# Altium project QuadcopterDesign.PrjPcb (part 3 of 3)

## Sheet [4] Peripheral_Module.SchDoc
size A4; Organization: UNMEI ELECTRICAL; Address1: 16B/12 Nguyen Du Street; Address2: Da Lat City, LD Province; SheetNumber: 4; SheetTotal: 6
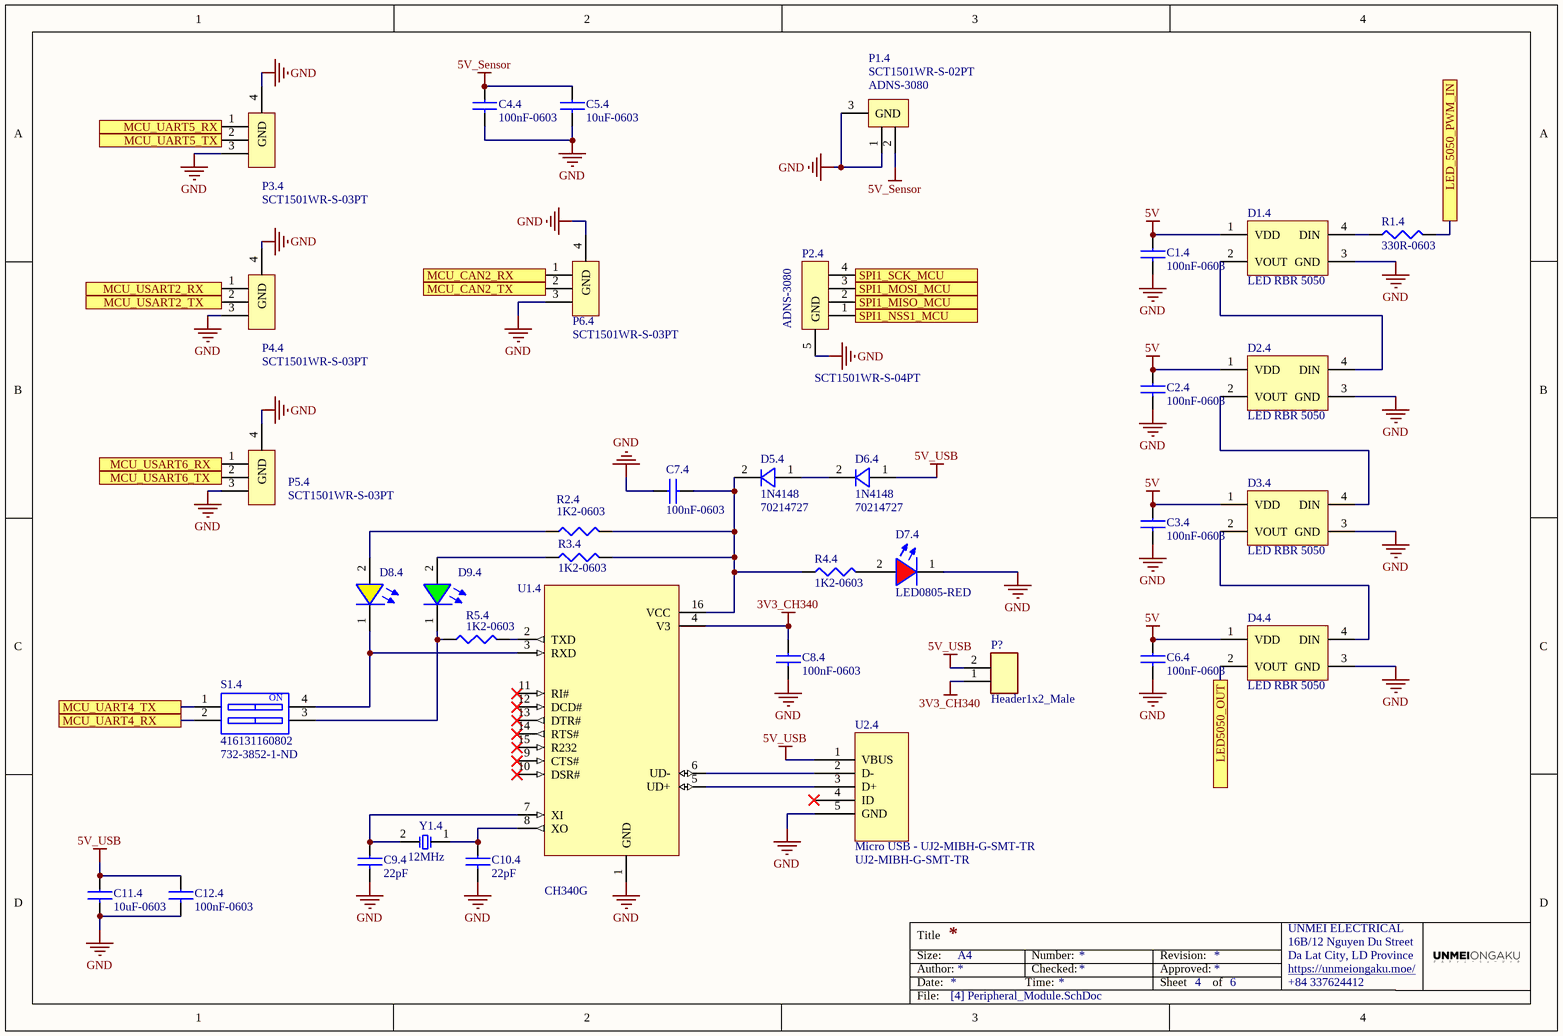
[diagram p3: [4] Peripheral_Module.SchDoc]

### Parts
C1.4  100nF-0603  [CAP0603]
C2.4  100nF-0603  [CAP0603]
C3.4  100nF-0603  [CAP0603]
C4.4  100nF-0603  [CAP0603]
C5.4  10uF-0603  [CAP0603]
C6.4  100nF-0603  [CAP0603]
C7.4  100nF-0603  [CAP0603]
C8.4  100nF-0603  [CAP0603]
C9.4  22pF  [CAP0603]
C10.4  22pF  [CAP0603]
C11.4  10uF-0603  [CAP0603]
C12.4  100nF-0603  [CAP0603]
D1.4  LED RBR 5050  [LED RGB  5050]
D2.4  LED RBR 5050  [LED RGB  5050]
D3.4  LED RBR 5050  [LED RGB  5050]
D4.4  LED RBR 5050  [LED RGB  5050]
D5.4  1N4148  Supplier Part Number 1: 70214727  [SOD-80]
D6.4  1N4148  Supplier Part Number 1: 70214727  [SOD-80]
D7.4  LED0805-RED  [LED0805-RED]
D8.4  YELLOW  [LED0805-YELLOW]  (value not drawn)
D9.4  GREEN  [LED0805-GREEN]  (value not drawn)
P1.4  SCT1501WR-S-02PT  [Connector ZH1.5 2P SMD]
P2.4  SCT1501WR-S-04PT  [Connector ZH1.5 4P SMD]
P3.4  SCT1501WR-S-03PT  [Connector ZH1.5 3P SMD]
P4.4  SCT1501WR-S-03PT  [Connector ZH1.5 3P SMD]
P5.4  SCT1501WR-S-03PT  [Connector ZH1.5 3P SMD]
P6.4  SCT1501WR-S-03PT  [Connector ZH1.5 3P SMD]
P?  Header1x2_Male  [HDR1x2_2.54_MALE]
R1.4  330R-0603  [RES0603 - 3D]
R2.4  1K2-0603  [RES0603 - 3D]
R3.4  1K2-0603  [RES0603 - 3D]
R4.4  1K2-0603  [RES0603 - 3D]
R5.4  1K2-0603  [RES0603 - 3D]
S1.4  416131160802  Supplier Part Number 1: 732-3852-1-ND  [DIP Switches SMD 1.27mm 2P]
U1.4  CH340G  [SOP16]
U2.4  Micro USB - UJ2-MIBH-G-SMT-TR  Supplier Part Number 1: UJ2-MIBH-G-SMT-TR  [Micro USB V2 SMD]
Y1.4  12MHz  [HC49-S]

### Ports
LED5050_OUT, LED_5050_PWM_IN, MCU_CAN2_RX, MCU_CAN2_TX, MCU_UART4_RX, MCU_UART4_TX, MCU_UART5_RX, MCU_UART5_TX, MCU_USART2_RX, MCU_USART2_TX, MCU_USART6_RX, MCU_USART6_TX, SPI1_MISO_MCU, SPI1_MOSI_MCU, SPI1_NSS1_MCU, SPI1_SCK_MCU

### Nets
3V3_CH340: C8.4.1 P?.1 U1.4.4(V3)
5V: C1.4.1 C2.4.1 C3.4.1 C4.4.1 C5.4.1 C6.4.1 D1.4.1(VDD) D2.4.1(VDD) D3.4.1(VDD) D4.4.1(VDD) P1.4.2  [also labelled 5V_Sensor]
5V_USB: C11.4.1 C12.4.1 D6.4.1(Anode) P?.2 U2.4.1(VBUS)
GND: C1.4.2 C2.4.2 C3.4.2 C4.4.2 C5.4.2 C6.4.2 C7.4.1 C8.4.2 C9.4.2 C10.4.2 C11.4.2 C12.4.2 D1.4.3(GND) D2.4.3(GND) D3.4.3(GND) D4.4.3(GND) D7.4.1(+) P1.4.1 P1.4.3(GND) P2.4.5(GND) P3.4.3 P3.4.4(GND) P4.4.3 P4.4.4(GND) P5.4.3 P5.4.4(GND) P6.4.3 P6.4.4(GND) U1.4.1(GND) U2.4.5(GND)
MCU_UART4_RX: S1.4.2 ; port MCU_UART4_RX
MCU_UART4_TX: S1.4.1 ; port MCU_UART4_TX
NetC7.4_2: C7.4.2 D5.4.2(Cathode) R2.4.2 R3.4.2 R4.4.1 U1.4.16(VCC)
NetC9.4_1: C9.4.1 U1.4.7(XI) Y1.4.2
NetC10.4_1: C10.4.1 U1.4.8(XO) Y1.4.1
NetD1.4_2: D1.4.2(VOUT) D2.4.4(DIN)
NetD1.4_4: D1.4.4(DIN) R1.4.1
NetD2.4_2: D2.4.2(VOUT) D3.4.4(DIN)
NetD3.4_2: D3.4.2(VOUT) D4.4.4(DIN)
NetD4.4_2: D4.4.2(VOUT) ; port LED5050_OUT
NetD5.4_1: D5.4.1(Anode) D6.4.2(Cathode)
NetD7.4_2: D7.4.2(+) R4.4.2
NetD8.4_1: D8.4.1(+) S1.4.4 U1.4.3(RXD)
NetD8.4_2: D8.4.2(+) R2.4.1
NetD9.4_1: D9.4.1(+) R5.4.1 S1.4.3
NetD9.4_2: D9.4.2(+) R3.4.1
NetP1.5_1: P2.4.4 ; port SPI1_SCK_MCU
NetP1.5_2: P2.4.3 ; port SPI1_MOSI_MCU
NetP1.5_3: P2.4.2 ; port SPI1_MISO_MCU
NetP2.4_1: P2.4.1 ; port SPI1_NSS1_MCU
NetP3.4_1: P3.4.1 ; port MCU_UART5_RX
NetP3.4_2: P3.4.2 ; port MCU_UART5_TX
NetP4.4_1: P4.4.1 ; port MCU_USART2_RX
NetP4.4_2: P4.4.2 ; port MCU_USART2_TX
NetP5.4_1: P5.4.1 ; port MCU_USART6_RX
NetP5.4_2: P5.4.2 ; port MCU_USART6_TX
NetP6.4_1: P6.4.1 ; port MCU_CAN2_RX
NetP6.4_2: P6.4.2 ; port MCU_CAN2_TX
NetR1.4_2: R1.4.2 ; port LED_5050_PWM_IN
NetR5.4_2: R5.4.2 U1.4.2(TXD)
NetU1.4_5: U1.4.5(UD+) U2.4.3(D+)
NetU1.4_6: U1.4.6(UD-) U2.4.2(D-)

Not connected (* = marked no-connect by the designer): U1.4 9(CTS#)* 10(DSR#)* 11(RI#)* 12(DCD#)* 13(DTR#)* 14(RTS#)* 15(R232)*; U2.4 4(ID)*

### Notes on the sheet
- (near P1.4) ADNS-3080
- (near P2.4) ADNS-3080
- Title
- Size:
- Date:
- Author:
- A4
- Time:
- Number:
- Checked:
- Revision:
- Sheet
- Approved:
- of
- https://unmeiongaku.moe/
- +84 337624412
- File:
- (in symbol 416131160802) ON

### Library data of the parts
C1.4 C2.4 C3.4 C6.4 = CC0603KRX7R0BB104: CAP CER 0.1UF 100V X7R 0603; Manufacturer: Yageo; Tolerance: ±10%; Value: 100nF; Supplier 1: Digi-Key; Manufacturer Part Number: CC0603KRX7R0BB104; RoHS: RoHS Compliant; Category: Capacitors; Stock 1: 784508; Pricing 1: 1=0.23, 10=0.156, 100=0.0791, 500=0.05414, 1000=0.0479 (USD); Packaging: Cut Tape (CT); Part Status: Active; Temperature Coefficient: X7R; Operating Temperature: -55°C ~ 125°C; Features: -; Ratings: -; Applications: General Purpose; Failure Rate: -; Mounting Type: Surface Mount, MLCC; Package / Case: 0603 (1608 Metric); Size / Dimension: 0.063" L x 0.032" W (1.60mm x 0.80mm); Height - Seated (Max): -; Thickness (Max): 0.035" (0.90mm); Lead Spacing: -; Lead Style: -; ComponentLink1URL: http://media.digikey.com/pdf/Data%20Sheets/Yageo%20PDFs/NPO,%20X7R%20Mid-voltage.pdf; ComponentLink1Description: http://media.digikey.com/pdf/Data%20Sheets/Yageo%20PDFs/NPO,%20X7R%20Mid-voltage.pdf; Supplier Part Number 1: 311-1523-1-ND; Voltage - Rated: 100V
C4.4 C7.4 C8.4 C12.4 = CC0603KRX7R9BB104: CAP CER 0.1UF 50V X7R 0603; Manufacturer 1: Yageo; Category 1: Capacitors; Capacitance: 0.1µF; Tolerance: ±10%; Value: 100nF; Supplier 1: Digi-Key; Supplier Part Number 1: 311-1344-1-ND; Manufacturer Part Number 1: CC0603KRX7R9BB104; RoHS 1: RoHS Compliant; Description 1: CAP CER 0.1UF 50V X7R 0603; Stock 1: 4411645; Pricing 1: 1=0.1, 10=0.031, 100=0.014, 500=0.00998, 1000=0.00783 (USD); Packaging: Cut Tape (CT); Part Status: Active; Voltage - Rated: 50V; Temperature Coefficient: X7R; Operating Temperature: -55°C ~ 125°C; Features: -; Ratings: -; Applications: General Purpose; Failure Rate: -; Mounting Type: Surface Mount, MLCC; Package / Case: 0603 (1608 Metric); Size / Dimension: 0.063" L x 0.031" W (1.60mm x 0.80mm); Height - Seated (Max): -; Thickness (Max): 0.035" (0.90mm); Lead Spacing: -; Lead Style: -; ComponentLink1URL: http://www.yageo.com/documents/recent/UPY-GPHC_X7R_6.3V-to-50V_18.pdf; ComponentLink1Description: http://www.yageo.com/documents/recent/UPY-GPHC_X7R_6.3V-to-50V_18.pdf
C5.4 C11.4 = CC0603KRX5R6BB106: CAP CER 10UF 10V X5R 0603; Manufacturer 1: Yageo; Category 1: Capacitors; Capacitance: 10µF; Tolerance: ±10%; Supplier 1: Digi-Key; Supplier Part Number 1: 311-1782-1-ND; Manufacturer Part Number 1: CC0603KRX5R6BB106; RoHS 1: RoHS Compliant; Description 1: CAP CER 10UF 10V X5R 0603; Stock 1: 66566; Pricing 1: 1=0.33, 10=0.225, 100=0.1272, 500=0.08982, 1000=0.07858 (USD); Packaging: Cut Tape (CT); Part Status: Active; Voltage - Rated: 10V; Temperature Coefficient: X5R; Operating Temperature: -55°C ~ 85°C; Features: -; Ratings: -; Applications: General Purpose; Failure Rate: -; Mounting Type: Surface Mount, MLCC; Package / Case: 0603 (1608 Metric); Size / Dimension: 0.063" L x 0.031" W (1.60mm x 0.80mm); Height - Seated (Max): -; Thickness (Max): 0.035" (0.90mm); Lead Spacing: -; Lead Style: -; ComponentLink1URL: http://www.yageo.com/documents/recent/UPY-GPHC_X5R_4V-to-50V_24.pdf; ComponentLink1Description: http://www.yageo.com/documents/recent/UPY-GPHC_X5R_4V-to-50V_24.pdf; Value: 10uF
C9.4 C10.4 = CC0603JRNPO9BN220: Surface Mount Ceramic Multilayer Capacitor 22pF 5% C0G 50V 0603 Paper T/R; Manufacturer: Yageo; Insulation Resistance: 10GR; Temperature Coefficient: 30ppm/°C; Supplier 1: Newark; Manufacturer Part Number: CC0603JRNPO9BN220; RoHS: Yes; Category: Ceramic Capacitors; Stock 1: 70605; Pricing 1: 1=0.10000, 10=0.02100, 25=0.02000, 50=0.01900, 100=0.01800 (USD); Mount: Surface Mount; Case/Package: 0603; Number of Pins: 2; Case Code (Imperial): 0603; Case Code (Metric): 1608; Min Operating Temperature: -55°C; Max Operating Temperature: 125°C; Capacitance: 22pF; Tolerance: 5%; Voltage Rating: 50V; Packaging: Tape and Reel; Dielectric: C0G; Termination: SMD/SMT; Series: CC; Voltage Rating (DC): 50V; Package Quantity: 1; Voltage: 50V; Length: 1.6mm; Width: 0.031inch; Height: 0.8mm; Thickness: 0.035inch; Depth: 0.8mm; Radiation Hardening: No; Lead Free: Lead Free; RoHS Compliant: Yes; Reach SVHC Compliant: Yes; Supplier Part Number 1: 46WX087
D1.4 D2.4 D3.4 D4.4 = LED RBR 5050 - IN-PI55QATPRPGPBPW-60: Address Led Discrete Serial Rgbw; Manufacturer: Inolux; Color: White,Blue,Green,Red; Lens Style: Round,Flat; Luminous Intensity: 1850mcd; Forward Voltage: 5.2V; Test Current: 12mA; Dominant Wavelength: 465nm; Supplier 1: Arrow Electronics; Manufacturer Part Number: IN-PI55QATPRPGPBPW-60; RoHS: No; Category: LEDs; Stock 1: 964; Pricing 1: 1=0.71450, 10=0.46990, 25=0.46520, 100=0.30470, 250=0.30220, 500=0.29430 (USD); Mount: Surface Mount; Case/Package: SMD/SMT; Packaging: Tape and Reel; Length: 5mm; Width: 5mm; Height: 1.7mm; ComponentLink1URL: http://www.inolux-corp.com/datasheet/SMDLED/Addressable%20LED/IN-PI55QATPRPGPBPW-XX_v1.2.pdf?src-supplier=Digi-Key; ComponentLink1Description: http://www.inolux-corp.com/datasheet/SMDLED/Addressable%20LED/IN-PI55QATPRPGPBPW-XX_v1.2.pdf?src-supplier=Digi-Key; Supplier Part Number 1: IN-PI55QATPRPGPBPW-60
D5.4 D6.4 = 1N4148: Rectifier Diode Small Signal Switching 100V 0.2A 4ns Automotive 2-Pin DO-35 Ammo; Manufacturer: NTE Electronics; Forward Voltage: 1V; Element Configuration: Single; Max Repetitive Reverse Voltage (Vrrm): 75V; Forward Current: 300mA; Current Rating: 200mA; Polarity: Standard; Capacitance: 4pF; Max Forward Surge Current (Ifsm): 1A; Power Dissipation: 500mW; Supplier 1: Allied Electronics; Manufacturer Part Number: 1N4148; RoHS: Yes; Category: Rectifier Diodes; Stock 1: 5690; Pricing 1: 1=0.08800 (USD); Mount: Through Hole; Case/Package: DO-35; Number of Pins: 2; Min Operating Temperature: -65°C; Max Operating Temperature: 175°C; Packaging: Tape and Reel; Reverse Recovery Time: 4ns; Voltage Rating (DC): 100V; Output Current: 200mA; Diameter: 2mm; Length: 4mm; RoHS Compliant: Yes; Lead Free: Lead Free; ComponentLink1URL: https://datasheet.ciiva.com/7624/1n4148-4448-7624426.pdf?src-supplier=Element14; ComponentLink1Description: https://datasheet.ciiva.com/7624/1n4148-4448-7624426.pdf?src-supplier=Element14
D8.4 = LED0805-YELLOW
D9.4 = LED0805-GREEN
P? = HDR1x2_2.54_MALE: Header1x2_2.54_MALE
R1.4 = RC0603JR-07330RL: RES SMD 330 OHM 5% 1/10W 0603; Manufacturer 1: Yageo; Category 1: Resistors; Resistance (Ohms): 330; Power (Watts): 0.1W, 1/10W; Temperature Coefficient: ±100ppm/°C; Value: 330R; Supplier 1: Digi-Key; Supplier Part Number 1: 311-330GRCT-ND; Manufacturer Part Number 1: RC0603JR-07330RL; RoHS 1: RoHS Compliant; Description 1: RES SMD 330 OHM 5% 1/10W 0603; Stock 1: 1463213; Pricing 1: 1=0.1, 10=0.011, 100=0.0046, 1000=0.00207, 2500=0.0018 (USD); Packaging: Cut Tape (CT); Part Status: Active; Tolerance: ±5%; Composition: Thick Film; Features: Moisture Resistant; Operating Temperature: -55°C ~ 155°C; Package / Case: 0603 (1608 Metric); Supplier Device Package: 0603; Size / Dimension: 0.063" L x 0.031" W (1.60mm x 0.80mm); Height - Seated (Max): 0.022" (0.55mm); Failure Rate: -; ComponentLink1URL: http://www.yageo.com/documents/recent/PYu-RC_Group_51_RoHS_L_7.pdf; ComponentLink1Description: http://www.yageo.com/documents/recent/PYu-RC_Group_51_RoHS_L_7.pdf
R2.4 R3.4 R4.4 R5.4 = RC0603JR-071K2L: RES SMD 1.2K OHM 5% 1/10W 0603; Manufacturer 1: Yageo; Category 1: Resistors; Power (Watts): 0.1W, 1/10W; Temperature Coefficient: ±100ppm/°C; Value: 1K2; Supplier 1: Digi-Key; Supplier Part Number 1: 311-1.2KGRCT-ND; Manufacturer Part Number 1: RC0603JR-071K2L; RoHS 1: RoHS Compliant; Description 1: RES SMD 1.2K OHM 5% 1/10W 0603; Stock 1: 286942; Pricing 1: 1=0.1, 10=0.011, 100=0.0046, 1000=0.00207, 2500=0.0018 (USD); Packaging: Cut Tape (CT); Part Status: Active; Resistance (Ohms): 1.2k; Tolerance: ±5%; Composition: Thick Film; Features: Moisture Resistant; Operating Temperature: -55°C ~ 155°C; Package / Case: 0603 (1608 Metric); Supplier Device Package: 0603; Size / Dimension: 0.063" L x 0.031" W (1.60mm x 0.80mm); Height - Seated (Max): 0.022" (0.55mm); Failure Rate: -; ComponentLink1URL: http://www.yageo.com/documents/recent/PYu-RC_Group_51_RoHS_L_7.pdf; ComponentLink1Description: http://www.yageo.com/documents/recent/PYu-RC_Group_51_RoHS_L_7.pdf
S1.4 = 416131160802: DIP Switch Dimensions L x W x H: 5.6 x 2 mm Series: WS-DISV L: 3.58 mm Poles: 2; Manufacturer: Wurth Electronics; Body Material: Polyphenylene,Polyphthalamide; Mechanical Life: 2000Cycles; Contact Current Rating: 25mA; Contact Resistance: 50mR; Number of Positions: 2; Voltage Rating (DC): 24V; Electrical Life: 1000Cycles; Throw Configuration: SPST; Insulation Resistance: 100MR; Actuator Type: Slide (Standard); Pitch: 0.05inch; Washable: Yes; Supplier 1: Digi-Key; Manufacturer Part Number: 416131160802; RoHS: Yes; Category: DIP Switches; Stock 1: 2793; Pricing 1: 1=5.06000, 10=4.81100, 50=4.55800, 100=4.05100, 500=3.79800 (USD); Mount: Surface Mount; Contact Material: Copper Alloy,Gold; Contact Plating: Gold; Min Operating Temperature: -40°C; Max Operating Temperature: 85°C; Package Quantity: 1; Packaging: Cut Tape; Current Rating: 25mA; Termination: Gull Wing; Number of Circuits: 2; Max Voltage Rating (DC): 24V; Series: WS-DISV; Length: 0.141inch; Width: 5.6mm; Height: 2mm; Lead Free: Lead Free; RoHS Compliant: Yes; ComponentLink1URL: https://datasheet.ciiva.com/30467/0900766b812902d9-30467106.pdf?src-supplier=RSComponents; ComponentLink1Description: https://datasheet.ciiva.com/30467/0900766b812902d9-30467106.pdf?src-supplier=RSComponents; ComponentLink2URL: https://datasheet.ciiva.com/2863/4161311608xx-2863669.pdf?src-supplier=Digi-Key; ComponentLink2Description: https://datasheet.ciiva.com/2863/4161311608xx-2863669.pdf?src-supplier=Digi-Key; ComponentLink3URL: https://datasheet.ciiva.com/2863/4161311608xx-2863670.pdf?src-supplier=Digi-Key; ComponentLink3Description: https://datasheet.ciiva.com/2863/4161311608xx-2863670.pdf?src-supplier=Digi-Key
U1.4 = CH340G: USB2UART
U2.4 = Micro USB - UJ2-MIBH-G-SMT-TR: Conn Micro USB 2.0 Type B RCP 5 POS 0.65mm Solder RA SMD 5 Terminal 1 Port T/R; Manufacturer: CUI Devices; Supplier 1: Arrow Electronics; Manufacturer Part Number: UJ2-MIBH-G-SMT-TR; RoHS: Yes; Category: USB Connectors; Stock 1: 6066; Pricing 1: 1=0.44640, 10=0.33470, 25=0.33130, 50=0.32680, 100=0.29350, 250=0.28070, 500=0.26500, 1000=0.21660, 2000=0.19850, 3000=0.19000, 5000=0.18820 (USD)
Y1.4 = Crystals - HC49SSDLF-8.00MHz: Crystals LO-PRO 8MHz; Manufacturer: Fox Electronics; Supplier 1: Mouser; Manufacturer Part Number: HC49SSDLF-8.00MHz; RoHS: Yes; Category: Uncategorized; Frequency: 8MHz; Packaging: Tape and Reel; Package Quantity: 1000; Termination: SMD/SMT; Length: 13.2mm; Width: 5mm; Height: 3.2mm; ComponentLink1URL: https://datasheet.ciiva.com/12388/hc49ssdlf-16337-12388064.pdf?src-supplier=Mouser; ComponentLink1Description: https://datasheet.ciiva.com/12388/hc49ssdlf-16337-12388064.pdf?src-supplier=Mouser; Supplier Part Number 1: 559-280LF-080

## Sheet [5] Radio Frequency.SchDoc
size A4; Organization: UNMEI ELECTRICAL; Address1: 16B/12 Nguyen Du Street; Address2: Da Lat City, LD Province; SheetNumber: 5; SheetTotal: 6
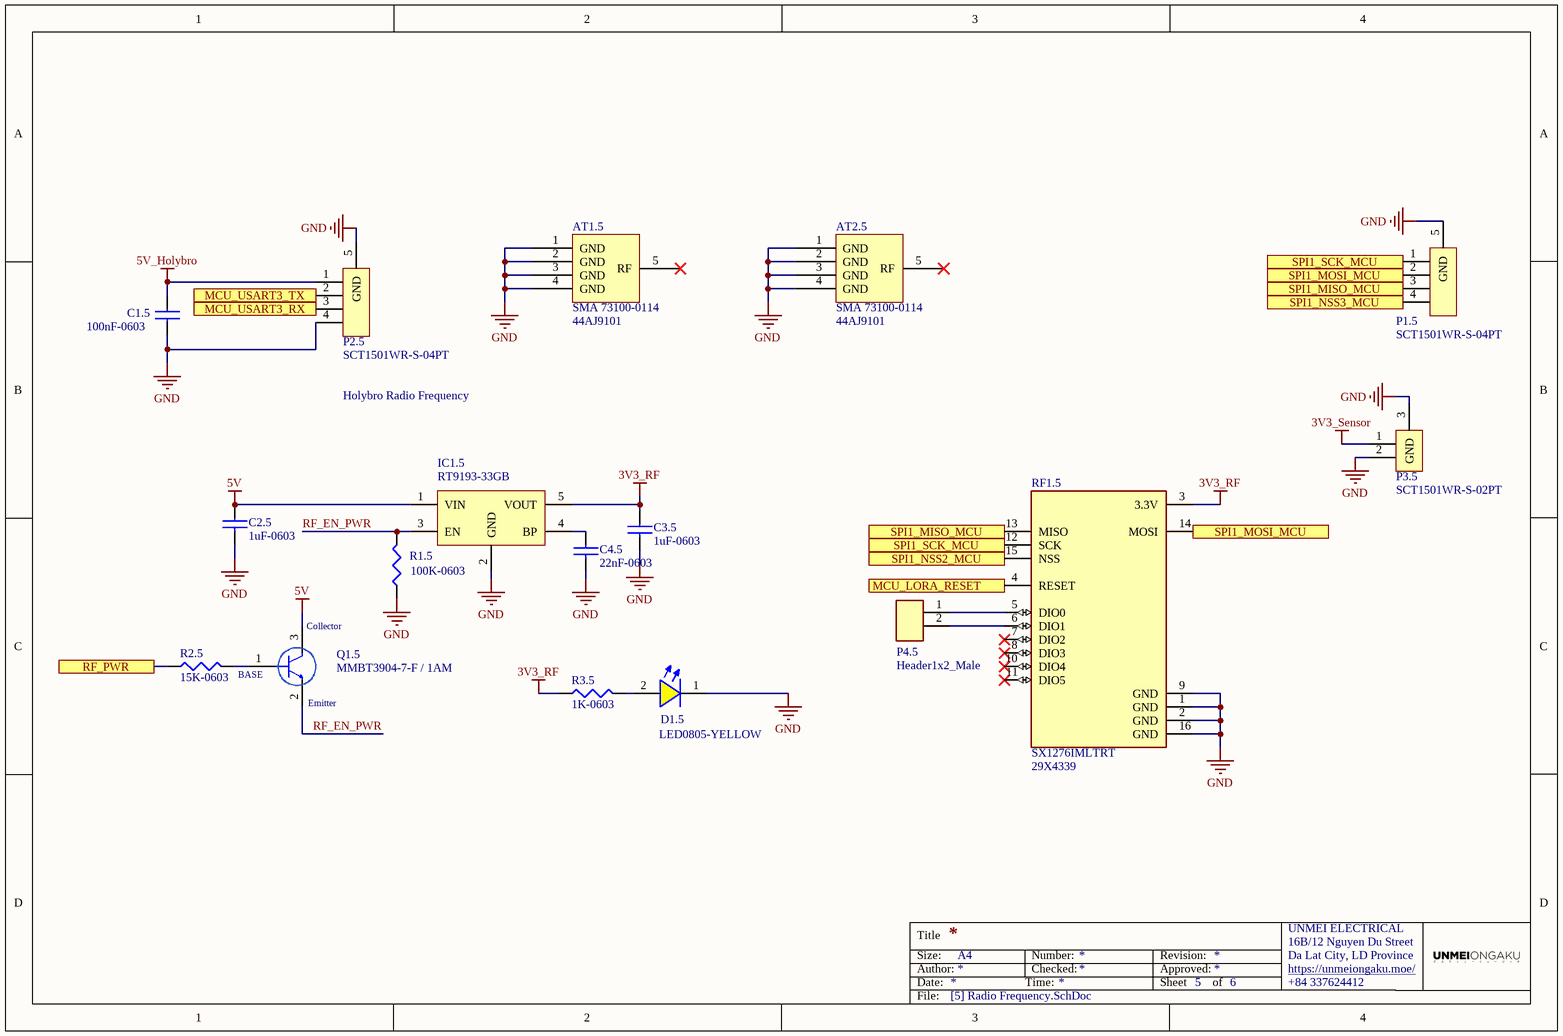
[diagram p4: [5] Radio Frequency.SchDoc]

### Parts
AT1.5  SMA 73100-0114  Supplier Part Number 1: 44AJ9101  [SMA Antenna Connection Jack]
AT2.5  SMA 73100-0114  Supplier Part Number 1: 44AJ9101  [SMA Antenna Connection Jack]
C1.5  100nF-0603  [CAP0603]
C2.5  1uF-0603  [CAP0603]
C3.5  1uF-0603  [CAP0603]
C4.5  22nF-0603  [CAP0603]
D1.5  LED0805-YELLOW  [LED0805-YELLOW]
IC1.5  RT9193-33GB  [SOT23-5]
P1.5  SCT1501WR-S-04PT  [Connector ZH1.5 4P SMD]
P2.5  SCT1501WR-S-04PT  [Connector ZH1.5 4P SMD]
P3.5  SCT1501WR-S-02PT  [Connector ZH1.5 2P SMD]
P4.5  Header1x2_Male  [HDR1x2_2.54_MALE]
Q1.5  MMBT3904-7-F / 1AM  [SOT23]
R1.5  100K-0603  [RES0603 - 3D]
R2.5  15K-0603  [RES0603 - 3D]
R3.5  1K-0603  [RES0603 - 3D]
RF1.5  SX1276IMLTRT  Supplier Part Number 1: 29X4339  [Lora SX1278 433MHz  / Ai-Thinker Ra-02]

### Ports
MCU_LORA_RESET, MCU_USART3_RX, MCU_USART3_TX, RF_PWR, SPI1_MISO_MCU, SPI1_MOSI_MCU, SPI1_NSS2_MCU, SPI1_NSS3_MCU, SPI1_SCK_MCU

### Nets
3V3_RF: C3.5.1 IC1.5.5(VOUT) R3.5.1 RF1.5.3(3.3V)
3V3_Sensor: P3.5.1
5V: C1.5.1 C2.5.1 IC1.5.1(VIN) P2.5.1 Q1.5.3  [also labelled 5V_Holybro]
GND: AT1.5.1(GND) AT1.5.2(GND) AT1.5.3(GND) AT1.5.4(GND) AT2.5.1(GND) AT2.5.2(GND) AT2.5.3(GND) AT2.5.4(GND) C1.5.2 C2.5.2 C3.5.2 C4.5.2 D1.5.1(+) IC1.5.2(GND) P1.5.5(GND) P2.5.4 P2.5.5(GND) P3.5.2 P3.5.3(GND) R1.5.1 RF1.5.1(GND) RF1.5.2(GND) RF1.5.9(GND) RF1.5.16(GND)
RF_EN_PWR: IC1.5.3(EN) Q1.5.2 R1.5.2
NetC4.5_1: C4.5.1 IC1.5.4(BP)
NetD1.5_2: D1.5.2(+) R3.5.2
NetP1.5_1: P1.5.1 RF1.5.12(SCK) ; port SPI1_SCK_MCU
NetP1.5_2: P1.5.2 RF1.5.14(MOSI) ; port SPI1_MOSI_MCU
NetP1.5_3: P1.5.3 RF1.5.13(MISO) ; port SPI1_MISO_MCU
NetP1.5_4: P1.5.4 ; port SPI1_NSS3_MCU
NetP2.5_2: P2.5.2 ; port MCU_USART3_TX
NetP2.5_3: P2.5.3 ; port MCU_USART3_RX
NetP4.5_1: P4.5.1 RF1.5.5(DIO0)
NetP4.5_2: P4.5.2 RF1.5.6(DIO1)
NetQ1.5_1: Q1.5.1 R2.5.2
NetR2.5_1: R2.5.1 ; port RF_PWR
NetRF1.5_4: RF1.5.4(RESET) ; port MCU_LORA_RESET
NetRF1.5_15: RF1.5.15(NSS) ; port SPI1_NSS2_MCU

Not connected (* = marked no-connect by the designer): AT1.5 5(RF)*; AT2.5 5(RF)*; RF1.5 7(DIO2)* 8(DIO3)* 10(DIO4)* 11(DIO5)*

### Notes on the sheet
- Holybro Radio Frequency
- Title
- Size:
- Date:
- Author:
- A4
- Time:
- Number:
- Checked:
- Revision:
- Sheet
- Approved:
- of
- https://unmeiongaku.moe/
- +84 337624412
- File:
- (in symbol MMBT3904-7-F / 1AM) Collector; BASE; Emitter

### Library data of the parts
AT1.5 AT2.5 = SMA 73100-0114: RF SMA Connector, 1 Contact(s), Female, Board Mount, Solder Terminal, Locking, Receptacle; Manufacturer: Molex; Body Material: Brass; Body Plating: Gold; Dielectric Material: PTFE; Polarity: Normal; Connector Type: PCB,SMA,Coaxial; Impedance: 50R; Frequency: 12Hz; Operating Frequency: 0 to 12Hz; Max Frequency: 18GHz; Voltage Rating: 500V; Supplier 1: Newark; Manufacturer Part Number: 73100-0114; RoHS: Yes; Category: RF / Coaxial Connectors; Stock 1: 2371; Pricing 1: 1=8.21000, 5=7.67000, 10=7.13000, 25=6.72000, 50=6.30000, 100=5.89000 (USD); Mount: Through Hole; Case/Package: SMA; Contact Plating: Gold; Contact Material: Copper; Insulation Material: Teflon; Housing Color: Gold; Plating: Gold; Center Contact Plating: Gold; Min Operating Temperature: -65°C; Max Operating Temperature: 165°C; Package Quantity: 1760; Packaging: Tray; Series: 73100; Termination: Solder; Orientation: Right Angle; Gender: Female; Fastening Type: Threaded; Length: 14.8mm; Radiation Hardening: No; RoHS Compliant: Yes
C1.5 = CC0603KRX7R9BB104: as C4.4 on sheet [4] Peripheral_Module; Supplier 1: Digi-Key; Supplier Part Number 1: 311-1344-1-ND; Manufacturer Part Number 1: CC0603KRX7R9BB104; RoHS 1: RoHS Compliant; Description 1: CAP CER 0.1UF 50V X7R 0603; Stock 1: 4411645; Pricing 1: 1=0.1, 10=0.031, 100=0.014, 500=0.00998, 1000=0.00783 (USD); Packaging: Cut Tape (CT); Part Status: Active; Voltage - Rated: 50V; Temperature Coefficient: X7R; Operating Temperature: -55°C ~ 125°C; Features: -; Ratings: -; Applications: General Purpose; Failure Rate: -; Mounting Type: Surface Mount, MLCC; Package / Case: 0603 (1608 Metric); Size / Dimension: 0.063" L x 0.031" W (1.60mm x 0.80mm); Height - Seated (Max): -; Thickness (Max): 0.035" (0.90mm); Lead Spacing: -; Lead Style: -; ComponentLink1URL: http://www.yageo.com/documents/recent/UPY-GPHC_X7R_6.3V-to-50V_18.pdf; ComponentLink1Description: http://www.yageo.com/documents/recent/UPY-GPHC_X7R_6.3V-to-50V_18.pdf
C2.5 C3.5 = CC0603KRX7R7BB105: CAP CER 1UF 16V X7R 0603; Manufacturer 1: Yageo; Category 1: Capacitors; Capacitance: 1µF; Tolerance: ±10%; Supplier 1: Digi-Key; Supplier Part Number 1: 311-1446-1-ND; Manufacturer Part Number 1: CC0603KRX7R7BB105; RoHS 1: RoHS Compliant; Description 1: CAP CER 1UF 16V X7R 0603; Stock 1: 274580; Pricing 1: 1=0.1, 10=0.051, 100=0.0227, 500=0.0162, 1000=0.01274 (USD); Packaging: Cut Tape (CT); Part Status: Active; Voltage - Rated: 16V; Temperature Coefficient: X7R; Operating Temperature: -55°C ~ 125°C; Features: -; Ratings: -; Applications: General Purpose; Failure Rate: -; Mounting Type: Surface Mount, MLCC; Package / Case: 0603 (1608 Metric); Size / Dimension: 0.063" L x 0.031" W (1.60mm x 0.80mm); Height - Seated (Max): -; Thickness (Max): 0.035" (0.90mm); Lead Spacing: -; Lead Style: -; ComponentLink1URL: http://www.yageo.com/documents/recent/UPY-GPHC_X7R_6.3V-to-50V_18.pdf; ComponentLink1Description: http://www.yageo.com/documents/recent/UPY-GPHC_X7R_6.3V-to-50V_18.pdf; Value: 1uF
C4.5 = CC0603KRX7R9BB223: Multilayer Ceramic Capacitors MLCC - SMD/SMT 22nF 50V X7R 10%; Manufacturer: Yageo; Capacitance: 0.022 uF; Type: General Purpose and High Capacitance Surface Mount Ceramic Multilayer Capacitor; Voltage Rating DC: 50 VDC; Capacitance - pF: 22000 pF; Class: Class 2; Supplier 1: Mouser; Manufacturer Part Number: CC0603KRX7R9BB223; RoHS: RoHS Compliant; Category: Multilayer Ceramic Capacitors MLCC - SMD/SMT; Stock 1: 23033; Pricing 1: 1=0.100, 10=0.064, 100=0.020, 1000=0.015, 4000=0.011, 8000=0.010, 24000=0.009 (USD); Height: 0.8 mm; Length: 1.6 mm; Package / Case: 0603 (1608 metric); Packaging: Cut Tape; Product: General Type MLCCs; Series: CC; Termination Style: SMD/SMT; Tolerance: 10 %; Width: 0.8 mm; Brand: Yageo; Capacitance - nF: 22 nF; Case Code - in: 0603; Case Code - mm: 1608; Dielectric: X7R; Maximum Operating Temperature: + 125 C; Minimum Operating Temperature: - 55 C; Product Type: Ceramic Capacitors; Standard Pack Qty: 4000; Subcategory: Capacitors; Termination: Standard; RoHS - Mouser: Y; Minimum Order Quantity: 1; Reeling: True; ComponentLink1URL: https://www.mouser.com/datasheet/2/447/UPY-GPHC_X7R_6.3V-to-50V_18-1154002.pdf; ComponentLink1Description: https://www.mouser.com/datasheet/2/447/UPY-GPHC_X7R_6.3V-to-50V_18-1154002.pdf; Supplier Part Number 1: 603-CC603KRX7R9BB223; Value: 22nF
IC1.5 = RT9193-33GB: IC REG LDO 3.3V 0.3A SOT23-5
P4.5 = HDR1x2_2.54_MALE: Header1x2_2.54_MALE
Q1.5 = MMBT3904-7-F / 1AM: Transistor General Purpose BJT NPN 40 Volt 0.2A Automotive 3-Pin SOT-23; Manufacturer: Diodes Zetex; Collector Emitter Breakdown Voltage: 40V; Max Power Dissipation: 300mW; Max Collector Current: 200mA; Transition Frequency: 300MHz; Collector Base Voltage (VCBO): 60V; Emitter Base Voltage (VEBO): 6V; Collector Emitter Saturation Voltage: 300mV; Element Configuration: Single; hFE Min: 100; Power Dissipation: 350mW; Number of Elements: 1; Supplier 1: Digi-Key; Manufacturer Part Number: MMBT3904-7-F; RoHS: Yes; Category: BJTs; Stock 1: 468030; Pricing 1: 3000=0.02271, 6000=0.02048, 15000=0.01781, 30000=0.01603, 75000=0.01425 (USD); Mount: Surface Mount; Case/Package: SOT-23; Number of Pins: 3; Contact Plating: Tin,Matte; Weight: 0.000282oz; Min Operating Temperature: -55°C; Max Operating Temperature: 150°C; Packaging: Tape and Reel; Polarity: NPN; Package Quantity: 3000; Collector Emitter Voltage (VCEO): 40V; Gain Bandwidth Product: 300MHz; Frequency: 300MHz; Max Breakdown Voltage: 40V; Series: -; Collector-emitter Voltage-Max: 300mV; Voltage Rating (DC): 40V; Max Frequency: 300MHz; Continuous Collector Current: 200mA; Length: 3.05mm; Width: 1.4mm; Height: 1mm; Radiation Hardening: No; RoHS Compliant: Yes; Lead Free: Lead Free; REACH SVHC: No SVHC; ComponentLink1URL: https://datasheet.ciiva.com/11201/ds30036-11201778.pdf?src-supplier=Avnet; ComponentLink1Description: https://datasheet.ciiva.com/11201/ds30036-11201778.pdf?src-supplier=Avnet; ComponentLink2URL: https://datasheet.ciiva.com/15138/getdatasheetpartid-53265-15138780.pdf?src-supplier=Verical; ComponentLink2Description: https://datasheet.ciiva.com/15138/getdatasheetpartid-53265-15138780.pdf?src-supplier=Verical; ComponentLink3URL: https://datasheet.ciiva.com/22711/1915516-22711750.pdf?src-supplier=Element14; ComponentLink3Description: https://datasheet.ciiva.com/22711/1915516-22711750.pdf?src-supplier=Element14; ComponentLink4URL: https://datasheet.ciiva.com/11198/ds30036-11198999.pdf?src-supplier=Avnet; ComponentLink4Description: https://datasheet.ciiva.com/11198/ds30036-11198999.pdf?src-supplier=Avnet; ComponentLink5URL: https://datasheet.ciiva.com/6361/ds30036-6361256.pdf?src-supplier=Digi-Key; ComponentLink5Description: https://datasheet.ciiva.com/6361/ds30036-6361256.pdf?src-supplier=Digi-Key; ComponentLink6URL: https://datasheet.ciiva.com/6361/ds30036-6361254.pdf?src-supplier=Digi-Key; ComponentLink6Description: https://datasheet.ciiva.com/6361/ds30036-6361254.pdf?src-supplier=Digi-Key; Supplier Part Number 1: MMBT3904-FDITR-ND
R1.5 = RC0603JR-07100KL: RES SMD 100K OHM 5% 1/10W 0603; Manufacturer 1: Yageo; Category 1: Resistors; Power (Watts): 0.1W, 1/10W; Temperature Coefficient: ±100ppm/°C; Supplier 1: Digi-Key; Supplier Part Number 1: 311-100KGRCT-ND; Manufacturer Part Number 1: RC0603JR-07100KL; RoHS 1: RoHS Compliant; Description 1: RES SMD 100K OHM 5% 1/10W 0603; Stock 1: 3591837; Pricing 1: 1=0.1, 10=0.011, 100=0.0044, 1000=0.00198, 2500=0.00172 (USD); Packaging: Cut Tape (CT); Part Status: Active; Resistance (Ohms): 100k; Tolerance: ±5%; Composition: Thick Film; Features: Moisture Resistant; Operating Temperature: -55°C ~ 155°C; Package / Case: 0603 (1608 Metric); Supplier Device Package: 0603; Size / Dimension: 0.063" L x 0.031" W (1.60mm x 0.80mm); Height - Seated (Max): 0.022" (0.55mm); Failure Rate: -; ComponentLink1URL: http://www.yageo.com/documents/recent/PYu-RC_Group_51_RoHS_L_7.pdf; ComponentLink1Description: http://www.yageo.com/documents/recent/PYu-RC_Group_51_RoHS_L_7.pdf; Value: 100K
R2.5 = RC0603JR-0715KL: Thick Film Resistors - SMD 15K OHM 5%; Manufacturer: Yageo; Power Rating: 100 mW, 200 mW; Resistance: 15 kOhms; Temperature Coefficient: 100 PPM / C; Voltage Rating: 75 V; Supplier 1: Mouser; Manufacturer Part Number: RC0603JR-0715KL; RoHS: RoHS Compliant; Category: Thick Film Resistors - SMD; Stock 1: 39889; Pricing 1: 1=0.100, 10=0.015, 100=0.005, 1000=0.004, 5000=0.004 (USD); Application: High Reliability; Features: -; Height: 0.45 mm; Length: 1.6 mm; Package / Case: 0603 (1608 metric); Packaging: Cut Tape; Product: Thick Film Resistors SMD; Series: RC; Technology: Thick Film; Termination Style: SMD/SMT; Tolerance: 5 %; Type: General Purpose; Width: 0.8 mm; Brand: Yageo; Mounting Style: PCB Mount; Case Code - in: 0603; Case Code - mm: 1608; Maximum Operating Temperature: + 155 C; Minimum Operating Temperature: - 55 C; Product Type: Thick Film Resistors; Standard Pack Qty: 5000; Subcategory: Resistors; RoHS - Mouser: Y; Minimum Order Quantity: 1; Reeling: True; ComponentLink1URL: http://www.mouser.com/datasheet/2/447/PYu-RC_Group_51_RoHS_L_9-1314892.pdf; ComponentLink1Description: http://www.mouser.com/datasheet/2/447/PYu-RC_Group_51_RoHS_L_9-1314892.pdf; Supplier Part Number 1: 603-RC0603JR-0715KL; Value: 15K
R3.5 = RC0603JR-071KL: RES SMD 1K OHM 5% 1/10W 0603; Manufacturer 1: Yageo; Category 1: Resistors; Power (Watts): 0.1W, 1/10W; Temperature Coefficient: ±100ppm/°C; Supplier 1: Digi-Key; Supplier Part Number 1: 311-1.0KGRCT-ND; Manufacturer Part Number 1: RC0603JR-071KL; RoHS 1: RoHS Compliant; Description 1: RES SMD 1K OHM 5% 1/10W 0603; Stock 1: 2853955; Pricing 1: 1=0.1, 10=0.011, 100=0.0044, 1000=0.00198, 2500=0.00172 (USD); Packaging: Cut Tape (CT); Part Status: Active; Resistance (Ohms): 1k; Tolerance: ±5%; Composition: Thick Film; Features: Moisture Resistant; Operating Temperature: -55°C ~ 155°C; Package / Case: 0603 (1608 Metric); Supplier Device Package: 0603; Size / Dimension: 0.063" L x 0.031" W (1.60mm x 0.80mm); Height - Seated (Max): 0.022" (0.55mm); Failure Rate: -; ComponentLink1URL: http://www.yageo.com/documents/recent/PYu-RC_Group_51_RoHS_L_7.pdf; ComponentLink1Description: http://www.yageo.com/documents/recent/PYu-RC_Group_51_RoHS_L_7.pdf; Value: 1K
RF1.5 = SX1276IMLTRT: Rf Ism Transceiver Fsk/gfsk/gmsk/msk/ook 3.3V Automotive 28-PIN QFN Ep T/r; Manufacturer: Semtech; Frequency: 137MHz; Data Rate: 300Kbps; Sensitivity: -148dBm; Number of GPIO: 6; Interface: SPI; Current - Receiving: 12mA; Current - Transmitting: 120mA; Operating Supply Voltage: 3.7V; Supplier 1: Newark; Manufacturer Part Number: SX1276IMLTRT; RoHS: Yes; Category: RF Receivers, Transceivers; Stock 1: 2848; Pricing 1: 1=9.90000, 10=9.04000, 25=8.28000, 50=7.88000, 100=7.47000, 250=6.87000, 500=6.24000 (USD); Case/Package: VQFN; Min Operating Temperature: -40°C; Max Operating Temperature: 85°C; Packaging: Tape and Reel; Package Quantity: 3000; Lead Free: Lead Free; RoHS Compliant: Yes; ComponentLink1URL: https://datasheet.ciiva.com/29635/sx1276-29635606.pdf?src-supplier=Digi-Key; ComponentLink1Description: https://datasheet.ciiva.com/29635/sx1276-29635606.pdf?src-supplier=Digi-Key; ComponentLink2URL: https://datasheet.ciiva.com/29635/sx1276-29635607.pdf?src-supplier=Digi-Key; ComponentLink2Description: https://datasheet.ciiva.com/29635/sx1276-29635607.pdf?src-supplier=Digi-Key; ComponentLink3URL: https://datasheet.ciiva.com/29635/sx1276-29635605.pdf?src-supplier=Digi-Key; ComponentLink3Description: https://datasheet.ciiva.com/29635/sx1276-29635605.pdf?src-supplier=Digi-Key

## Sheet [6] Motor_Control.SchDoc
size A4; Organization: UNMEI ELECTRICAL; Address1: 16B/12 Nguyen Du Street; Address2: Da Lat City, LD Province; SheetNumber: 6; SheetTotal: 6
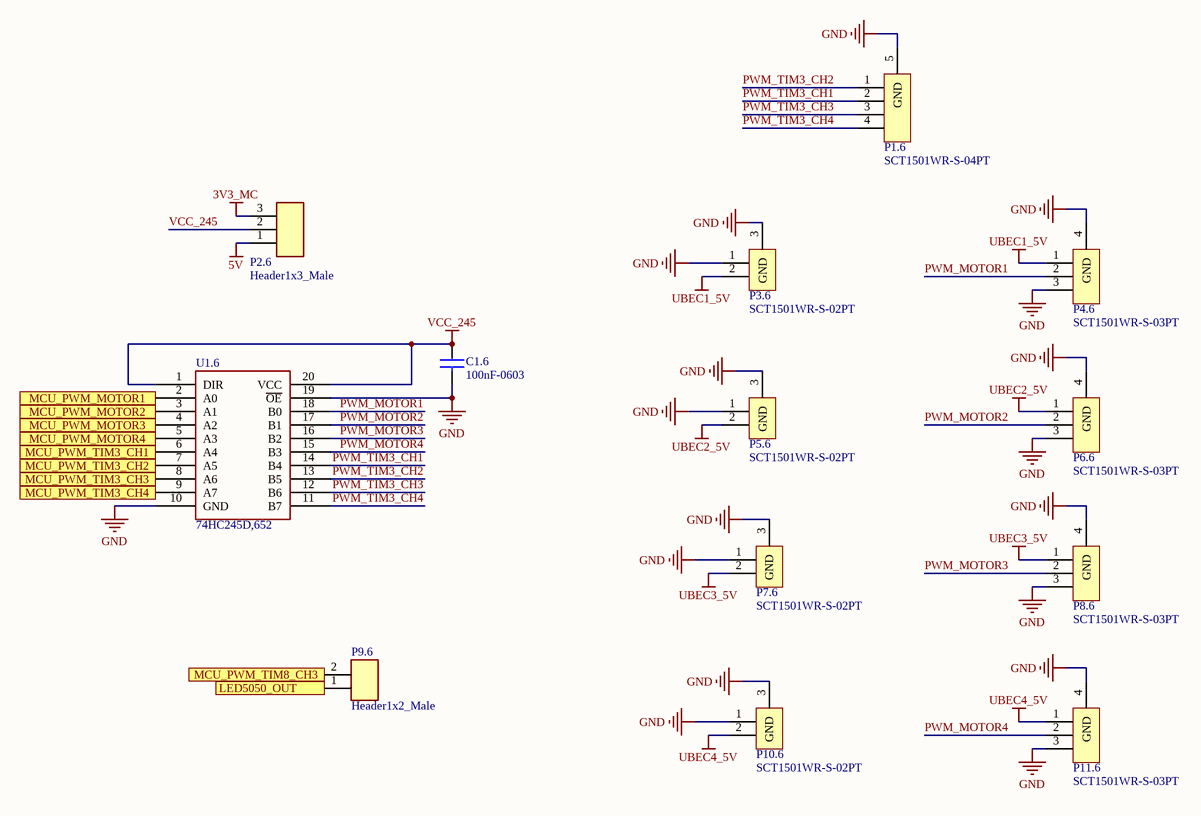
[diagram p5: [6] Motor_Control.SchDoc]

### Parts
C1.6  100nF-0603  [CAP0603]
P1.6  SCT1501WR-S-04PT  [Connector ZH1.5 4P SMD]
P2.6  Header1x3_Male  [HDR1x3_2.54_MALE]
P3.6  SCT1501WR-S-02PT  [Connector ZH1.5 2P SMD]
P4.6  SCT1501WR-S-03PT  [Connector ZH1.5 3P SMD]
P5.6  SCT1501WR-S-02PT  [Connector ZH1.5 2P SMD]
P6.6  SCT1501WR-S-03PT  [Connector ZH1.5 3P SMD]
P7.6  SCT1501WR-S-02PT  [Connector ZH1.5 2P SMD]
P8.6  SCT1501WR-S-03PT  [Connector ZH1.5 3P SMD]
P9.6  Header1x2_Male  [HDR1x2_2.54_MALE]
P10.6  SCT1501WR-S-02PT  [Connector ZH1.5 2P SMD]
P11.6  SCT1501WR-S-03PT  [Connector ZH1.5 3P SMD]
U1.6  74HC245D,652  [SOT163-1_NEX]

### Ports
LED5050_OUT, MCU_PWM_MOTOR1, MCU_PWM_MOTOR2, MCU_PWM_MOTOR3, MCU_PWM_MOTOR4, MCU_PWM_TIM3_CH1, MCU_PWM_TIM3_CH2, MCU_PWM_TIM3_CH3, MCU_PWM_TIM3_CH4, MCU_PWM_TIM8_CH3

### Nets
3V3_MC: P2.6.3
5V: P2.6.1
GND: C1.6.2 P1.6.5(GND) P3.6.1 P3.6.3(GND) P4.6.3 P4.6.4(GND) P5.6.1 P5.6.3(GND) P6.6.3 P6.6.4(GND) P7.6.1 P7.6.3(GND) P8.6.3 P8.6.4(GND) P10.6.1 P10.6.3(GND) P11.6.3 P11.6.4(GND) U1.6.10(GND) U1.6.19(~{OE})
UBEC1_5V: P3.6.2 P4.6.1
UBEC2_5V: P5.6.2 P6.6.1
UBEC3_5V: P7.6.2 P8.6.1
UBEC4_5V: P10.6.2 P11.6.1
VCC_245: C1.6.1 P2.6.2 U1.6.1(DIR) U1.6.20(VCC)
PWM_MOTOR1: P4.6.2 U1.6.18(B0)
PWM_MOTOR2: P6.6.2 U1.6.17(B1)
PWM_MOTOR3: P8.6.2 U1.6.16(B2)
PWM_MOTOR4: P11.6.2 U1.6.15(B3)
PWM_TIM3_CH1: P1.6.2 U1.6.14(B4)
PWM_TIM3_CH2: P1.6.1 U1.6.13(B5)
PWM_TIM3_CH3: P1.6.3 U1.6.12(B6)
PWM_TIM3_CH4: P1.6.4 U1.6.11(B7)
NetD4.4_2: P9.6.1 ; port LED5050_OUT
NetP9.6_2: P9.6.2 ; port MCU_PWM_TIM8_CH3
NetU1.2_26: U1.6.8(A6) ; port MCU_PWM_TIM3_CH3
NetU1.2_27: U1.6.9(A7) ; port MCU_PWM_TIM3_CH4
NetU1.2_41: U1.6.2(A0) ; port MCU_PWM_MOTOR1
NetU1.2_42: U1.6.3(A1) ; port MCU_PWM_MOTOR2
NetU1.2_43: U1.6.4(A2) ; port MCU_PWM_MOTOR3
NetU1.2_44: U1.6.5(A3) ; port MCU_PWM_MOTOR4
NetU1.2_56: U1.6.6(A4) ; port MCU_PWM_TIM3_CH1
NetU1.2_57: U1.6.7(A5) ; port MCU_PWM_TIM3_CH2

### Notes on the sheet
- Title
- Size:
- Date:
- Author:
- A4
- Time:
- Number:
- Checked:
- Revision:
- Sheet
- Approved:
- of
- https://unmeiongaku.moe/
- +84 337624412
- File:

### Library data of the parts
C1.6 = CC0603KRX7R9BB104: as C4.4 on sheet [4] Peripheral_Module; Supplier 1: Digi-Key; Supplier Part Number 1: 311-1344-1-ND; Manufacturer Part Number 1: CC0603KRX7R9BB104; RoHS 1: RoHS Compliant; Description 1: CAP CER 0.1UF 50V X7R 0603; Stock 1: 4411645; Pricing 1: 1=0.1, 10=0.031, 100=0.014, 500=0.00998, 1000=0.00783 (USD); Packaging: Cut Tape (CT); Part Status: Active; Voltage - Rated: 50V; Temperature Coefficient: X7R; Operating Temperature: -55°C ~ 125°C; Features: -; Ratings: -; Applications: General Purpose; Failure Rate: -; Mounting Type: Surface Mount, MLCC; Package / Case: 0603 (1608 Metric); Size / Dimension: 0.063" L x 0.031" W (1.60mm x 0.80mm); Height - Seated (Max): -; Thickness (Max): 0.035" (0.90mm); Lead Spacing: -; Lead Style: -; ComponentLink1URL: http://www.yageo.com/documents/recent/UPY-GPHC_X7R_6.3V-to-50V_18.pdf; ComponentLink1Description: http://www.yageo.com/documents/recent/UPY-GPHC_X7R_6.3V-to-50V_18.pdf
P2.6 = HDR1x3_2.54_MALE: Header1x3_2.54_MALE
P9.6 = HDR1x2_2.54_MALE: Header1x2_2.54_MALE
U1.6 = 74HC245D,652: Vendor: Nexperia; SourceLibrary: Nexperia_2018-05-2018; Manufacturer_Part_Number: 74HC245D,652; Copyright: Copyright (C) 2016 Accelerated Designs. All rights reserved; RefDes: RefDes; Type: DEV; Local Supplier: thegioiic; Local Supplier Part number: *; Local Supplier Link: https://www.thegioiic.com/products/74hc245d

## Nets that join several sheets
3V3_MC: [1] PowerSupply (5 pins), [2] MicroController (17 pins), [6] Motor_Control (P2.6.3)
3V3_Sensor: [1] PowerSupply (C3.1.1 IC1.1.2 IC1.1.4), [3] Sensor (16 pins), [5] Radio Frequency (P3.5.1)
5V: [1] PowerSupply (8 pins), [2] MicroController (B1.2.1), [4] Peripheral_Module (11 pins), [5] Radio Frequency (5 pins), [6] Motor_Control (P2.6.1)
GND: [1] PowerSupply (34 pins), [2] MicroController (29 pins), [3] Sensor (31 pins), [4] Peripheral_Module (30 pins), [5] Radio Frequency (24 pins), [6] Motor_Control (20 pins)
MCU_UART4_RX: [2] MicroController (P2.2.1 U1.2.15), [4] Peripheral_Module (S1.4.2)
MCU_UART4_TX: [2] MicroController (P2.2.2 U1.2.14), [4] Peripheral_Module (S1.4.1)
NetD4.4_2: [4] Peripheral_Module (D4.4.2), [6] Motor_Control (P9.6.1)
NetIC1.3_5: [2] MicroController (U1.2.62), [3] Sensor (7 pins)
NetIC1.3_6: [2] MicroController (U1.2.61), [3] Sensor (7 pins)
NetP1.3_1: [2] MicroController (U1.2.50), [3] Sensor (P1.3.1 S1.3.1)
NetP1.3_2: [2] MicroController (U1.2.55), [3] Sensor (P1.3.2 S1.3.2)
NetP1.3_3: [2] MicroController (U1.2.29), [3] Sensor (P1.3.3 S1.3.3)
NetP1.3_4: [2] MicroController (U1.2.30), [3] Sensor (P1.3.4 S1.3.4)
NetP1.5_1: [2] MicroController (U1.2.21), [4] Peripheral_Module (P2.4.4), [5] Radio Frequency (P1.5.1 RF1.5.12)
NetP1.5_2: [2] MicroController (U1.2.23), [4] Peripheral_Module (P2.4.3), [5] Radio Frequency (P1.5.2 RF1.5.14)
NetP1.5_3: [2] MicroController (U1.2.22), [4] Peripheral_Module (P2.4.2), [5] Radio Frequency (P1.5.3 RF1.5.13)
NetP1.5_4: [2] MicroController (U1.2.25), [5] Radio Frequency (P1.5.4)
NetP2.4_1: [2] MicroController (U1.2.20), [4] Peripheral_Module (P2.4.1)
NetP2.5_2: [2] MicroController (U1.2.51), [5] Radio Frequency (P2.5.2)
NetP2.5_3: [2] MicroController (U1.2.52), [5] Radio Frequency (P2.5.3)
NetP3.4_1: [2] MicroController (U1.2.54), [4] Peripheral_Module (P3.4.1)
NetP3.4_2: [2] MicroController (U1.2.53), [4] Peripheral_Module (P3.4.2)
NetP4.4_1: [2] MicroController (U1.2.17), [4] Peripheral_Module (P4.4.1)
NetP4.4_2: [2] MicroController (U1.2.16), [4] Peripheral_Module (P4.4.2)
NetP5.1_2: [1] PowerSupply (P5.1.2), [2] MicroController (U1.2.9)
NetP5.4_1: [2] MicroController (U1.2.38), [4] Peripheral_Module (P5.4.1)
NetP5.4_2: [2] MicroController (U1.2.37), [4] Peripheral_Module (P5.4.2)
NetP6.4_1: [2] MicroController (U1.2.33), [4] Peripheral_Module (P6.4.1)
NetP6.4_2: [2] MicroController (U1.2.34), [4] Peripheral_Module (P6.4.2)
NetP9.6_2: [2] MicroController (U1.2.39), [6] Motor_Control (P9.6.2)
NetR1.4_2: [2] MicroController (U1.2.40), [4] Peripheral_Module (R1.4.2)
NetR2.5_1: [2] MicroController (U1.2.8), [5] Radio Frequency (R2.5.1)
NetRF1.5_4: [2] MicroController (U1.2.45), [5] Radio Frequency (RF1.5.4)
NetRF1.5_15: [2] MicroController (U1.2.24), [5] Radio Frequency (RF1.5.15)
NetU1.2_26: [2] MicroController (U1.2.26), [6] Motor_Control (U1.6.8)
NetU1.2_27: [2] MicroController (U1.2.27), [6] Motor_Control (U1.6.9)
NetU1.2_41: [2] MicroController (U1.2.41), [6] Motor_Control (U1.6.2)
NetU1.2_42: [2] MicroController (U1.2.42), [6] Motor_Control (U1.6.3)
NetU1.2_43: [2] MicroController (U1.2.43), [6] Motor_Control (U1.6.4)
NetU1.2_44: [2] MicroController (U1.2.44), [6] Motor_Control (U1.6.5)
NetU1.2_56: [2] MicroController (U1.2.56), [6] Motor_Control (U1.6.6)
NetU1.2_57: [2] MicroController (U1.2.57), [6] Motor_Control (U1.6.7)